# Altium schematic sheet SH4 - 17V BUCK CONVERTER.SchDoc: Power Distribution Board Rev2 - 17V Buck Converter
size Letter; DrawnBy: Cindy Li; Organization: UW Robotics; Address1: 200 University Avenue; Address2: Waterloo; Address3: Ontario; Address4: Canada N2L 3G6; DocumentNumber: 4; SheetNumber: 4; SheetTotal: 11
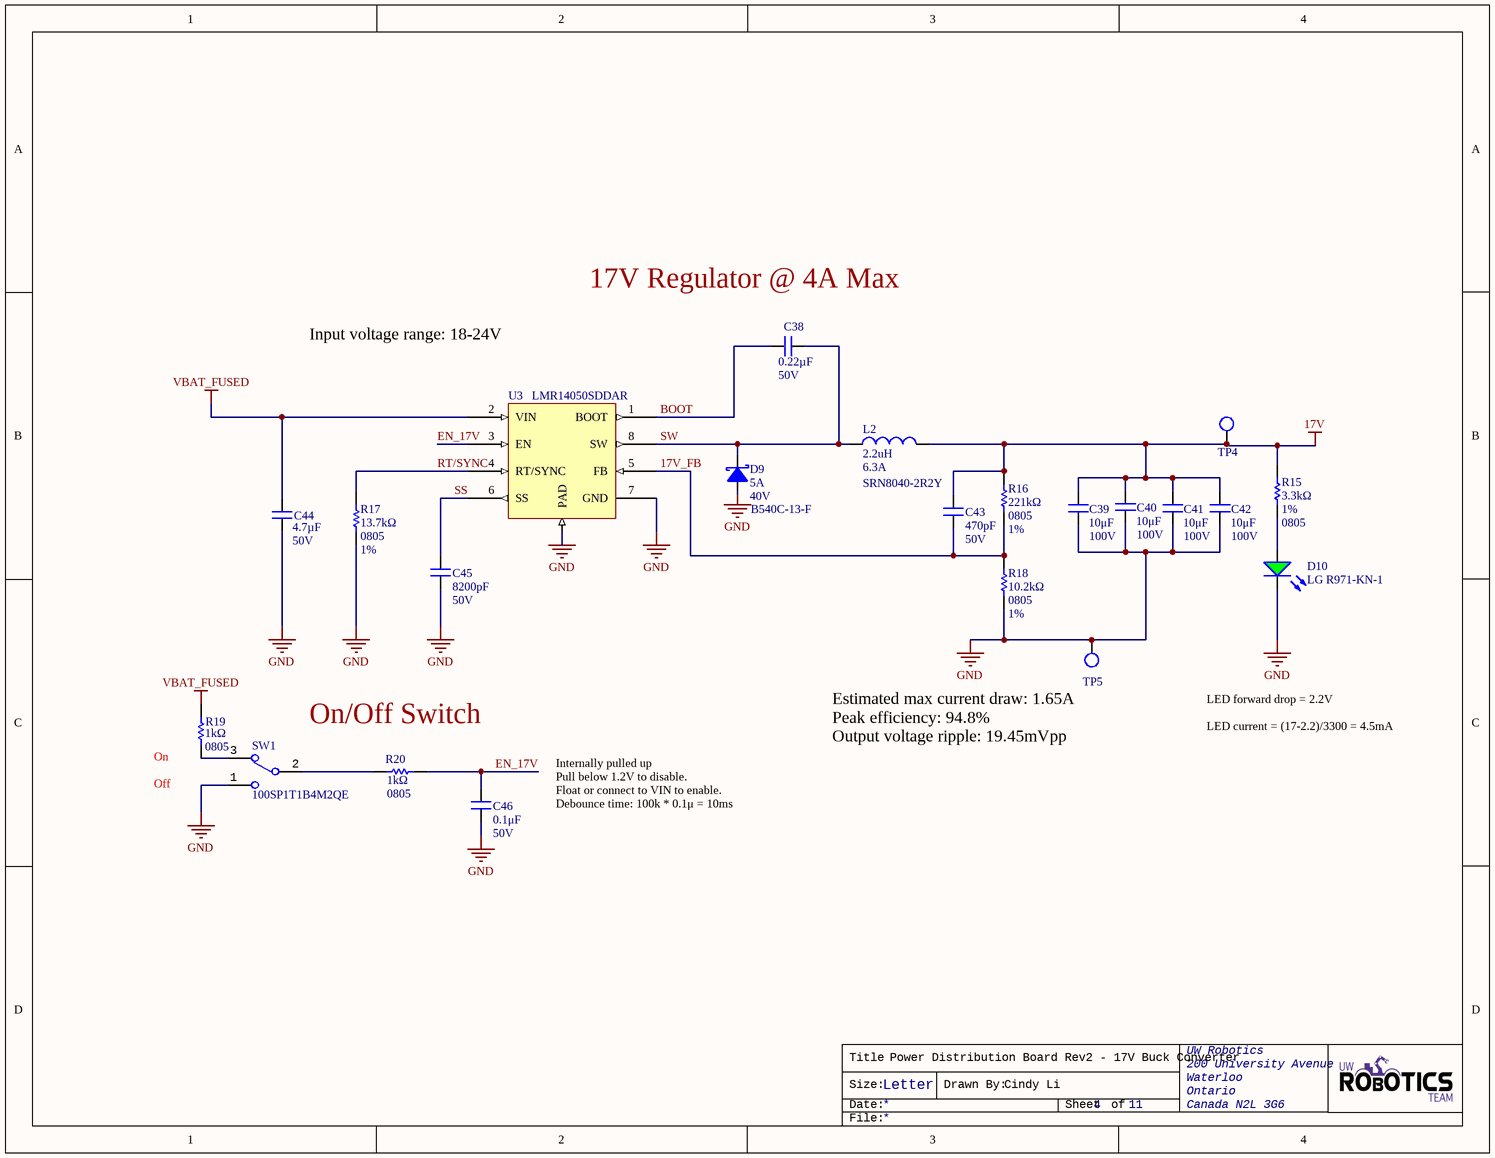
[diagram p0: SH4 - 17V BUCK CONVERTER.SchDoc]

## Parts
C38  Voltage Rating: 50V  Capacitance: 0.22µF  [CAP2012]  (hidden comment: GRM21BR71H224MA01L)
C39  value 10μF  Voltage Rating: 100V  [CAP1210]  (hidden comment: CAP_10uF_100V_1210)
C40  value 10μF  Voltage Rating: 100V  [CAP1210]  (hidden comment: CAP_10uF_100V_1210)
C41  value 10μF  Voltage Rating: 100V  [CAP1210]  (hidden comment: CAP_10uF_100V_1210)
C42  value 10μF  Voltage Rating: 100V  [CAP1210]  (hidden comment: CAP_10uF_100V_1210)
C43  470pF  Voltage Rating: 50V  [CAP2012]
C44  Voltage Rating: 50V  Capacitance: 4.7µF  [CAP1206]  (hidden comment: GRM31CR71H475KA12L)
C45  8200pF  Voltage Rating: 50V  [CAP2012]
C46  0.1μF  Voltage Rating: 50V  [CAP2012]
D9  Forward Current: 5A  Voltage: 40V  [DO214AB SMC]  (hidden comment: B540C-13-F)
D10  LG R971-KN-1  [LED_0805_GREEN]
L2  Inductance: 2.2uH  Max DC Current: 6.3A  [IND_BOURNS_SRN80]  (hidden comment: SRN8040-2R2Y)
R15  3.3kΩ  Tolerance: 1%  Case Code (Imperial): 0805  [RESC2012X60N]
R16  221kΩ  Case Code (Imperial): 0805  Tolerance: 1%  [RESC2012X60N]
R17  13.7kΩ  Case Code (Imperial): 0805  Tolerance: 1%  [RESC2012X60N]
R18  10.2kΩ  Case Code (Imperial): 0805  Tolerance: 1%  [RESC2012X60N]
R19  Case Code (Imperial): 0805  [RESC2012X60N]  (hidden comment: 1kΩ)
R20  1kΩ  Case Code (Imperial): 0805  [RESC2012X60N]
SW1  100SP1T1B4M2QE  [100SP1T1B4M2QE]
TP4  TESTPOINT_LOOP  [TESTPOINT_LOOP]  (value not drawn)
TP5  TESTPOINT_LOOP  [TESTPOINT_LOOP]  (value not drawn)
U3  LMR14050SDDAR  [8-PowerSOIC]

## Nets
17V: C39.2 C40.2 C41.2 C42.2 C43.2 L2.2 R15.2 R16.2 TP4.1
GND: C39.1 C40.1 C41.1 C42.1 C44.2 C45.1 C46.1 D9.1(Anode) D10.2(K) R17.1 R18.1 SW1.1 TP5.1 U3.7(GND) U3.9(PAD)
VBAT_FUSED: C44.1 R19.2 U3.2(VIN)
17V_FB: C43.1 R16.1 R18.2 U3.5(FB)
BOOT: C38.2 U3.1(BOOT)
EN_17V: C46.2 R20.2 U3.3(EN)
RT/SYNC: R17.2 U3.4(RT/SYNC)
SS: C45.2 U3.6(SS)
SW: C38.1 D9.2(Cathode) L2.1 U3.8(SW)
NetD10_1: D10.1(A) R15.1
NetR19_1: R19.1 SW1.3
NetR20_1: R20.1 SW1.2

## Notes on the sheet
- (near C38) 17V Regulator @ 4A Max
- Input voltage range: 18-24V
- (near R19) On
- On/Off Switch
- (near TP5) Estimated max current draw: 1.65A
  Peak efficiency: 94.8%
  Output voltage ripple: 19.45mVpp
- LED forward drop = 2.2V
  LED current = (17-2.2)/3300 = 4.5mA
- (near R19) Off
- Internally pulled up
  Pull below 1.2V to disable.
  Float or connect to VIN to enable.
  Debounce time: 100k * 0.1μ = 10ms
- Title
- Size:
- Date:
- Letter
- Drawn By:
- Sheet
- of
- File:

## Library data of the parts
C38 = GRM21BR71H224MA01L: CAP CER 0.22UF 50V X7R 0805; Manufacturer 1: Murata; Tolerance: 20%; Manufacturer Part Number 1: GRM21BR71H224MA01L; Mount: Surface Mount; Case/Package: 0805; Case Code (Metric): 2012; Case Code (Imperial): 0805; Min Operating Temperature: -55°C; Max Operating Temperature: 125°C; Dielectric: X7R; Termination: SMD/SMT; Voltage Rating (DC): 50V; Length: 2mm; Height: 1.25mm; Width: 0.049inch; Thickness: 0.053inch; Depth: 1.25mm; Supplier 1: Digi-Key; Supplier Part Number 1: 490-1671-1-ND; Package: 0805 (2012 Metric)
C39-C42 = CAP_10uF_100V_1210: CAP CER 10uF 100V X7S 10% 1210; Manufacturer 1: Murata; Manufacturer Part Number 1: GRM32EC72A106KE05L; Supplier Part Number 1: 490-16266-1-ND; Supplier 1: Digi-Key; Category: Ceramic Capacitors; Mount: Surface Mount; Case Code (Metric): 3225; Case Code (Imperial): 1210; Min Operating Temperature: -55°C; Max Operating Temperature: 125°C; Dielectric: X7S; Tolerance: 10%; Package: 1210 (3225 Metric)
C43 = CAP_470pF_50V_0805: CAP CER 470PF 50V X7R 0805; Manufacturer 1: Kyocera AVX; Manufacturer Part Number 1: 08055C471JAT2A; Tolerance: 5%; Dissipation Factor: 2.5%; Supplier 1: Digi-Key; Mount: Surface Mount; Number of Pins: 2; Case Code (Metric): 2012; Case Code (Imperial): 0805; Min Operating Temperature: -55°C; Max Operating Temperature: 125°C; Dielectric: X7R; Voltage Rating (DC): 50V; Termination: SMD/SMT; Length: 2.01mm; Height: 0.94mm; Width: 0.049inch; Thickness: 0.037inch; Depth: 1.25mm; REACH SVHC: Unknown; ComponentLink7URL: https://datasheet.ciiva.com/14906/cx7r-14906253.pdf?src-supplier=Digi-Key; ComponentLink7Description: https://datasheet.ciiva.com/14906/cx7r-14906253.pdf?src-supplier=Digi-Key; Supplier Part Number 1: 478-7958-1-ND; Capacitance: 470pF; Package: 0805 (2012 Metric); Contact Plating: Tin,Matte
C44 = GRM31CR71H475KA12L: CAP CER 4.7UF 50V X7R 1206; Manufacturer 1: Murata; Material: Ceramic; Tolerance: 10%; Value: 4.7µF; Supplier 1: Digi-Key; Manufacturer Part Number 1: GRM31CR71H475KA12L; Mount: Surface Mount; Case/Package: 1206; Case Code (Metric): 3216; Case Code (Imperial): 1206; Min Operating Temperature: -55°C; Max Operating Temperature: 125°C; Dielectric: X7R; Voltage Rating (DC): 50V; Termination: SMD/SMT; Voltage: 50V; Length: 3.2mm; Height: 1.6mm; Width: 0.063inch; Thickness: 0.071inch; Depth: 1.6mm; REACH SVHC: No SVHC; ComponentLink7URL: https://datasheet.ciiva.com/6270/partnumbering-e-01-6270218.pdf?src-supplier=Digi-Key; ComponentLink7Description: https://datasheet.ciiva.com/6270/partnumbering-e-01-6270218.pdf?src-supplier=Digi-Key; ComponentLink8URL: https://datasheet.ciiva.com/6270/partnumbering-e-01-6270219.pdf?src-supplier=Digi-Key; ComponentLink8Description: https://datasheet.ciiva.com/6270/partnumbering-e-01-6270219.pdf?src-supplier=Digi-Key; Supplier Part Number 1: 490-6521-1-ND; Package: 1206 (3216 Metric)
C45 = CAP_8200pF_50V_0805: CAP CER 8200PF 50V X7R 0805; Tolerance: 10%; Capacitance: 8.2nF; Mount: Surface Mount; Case Code (Metric): 2012; Case Code (Imperial): 0805; Min Operating Temperature: -55°C; Max Operating Temperature: 125°C; Dielectric: X7R; Voltage Rating (DC): 50V; Termination: SMD/SMT; Length: 0.079inch; Width: 0.049inch; Thickness: 0.037inch; Depth: 1.25mm; Supplier 1: Digi-Key; Supplier Part Number 1: 478-9924-6-ND; Number of Pins: 2; Ratings: AEC-Q200; Package: 0805 (2012 Metric)
C46 = CAP_0.1uF_50V_0805: CAP CER 0.1UF 50V X7R 0805; Manufacturer Part Number 1: GCD21BR71H104KA01L; Manufacturer 1: Murata Electronics; Tolerance: 10%; Package: 0805 (2012 Metric); Supplier Part Number 1: 490-11955-1-ND; Supplier 1: Digi-Key; Mount: Surface Mount; Value: 0.1μF; Case Code (Imperial): 0805; Case Code (Metric): 2012; Dielectric: X7R; Min Operating Temperature: -55°C; Max Operating Temperature: 125°C; Termination: SMD/SMT; Length: 2mm; Height: 1.25mm; Width: 0.049inch; Thickness: 0.049inch; Depth: 1.25mm; Ratings: AEC-Q200
D9 = B540C-13-F: DIODE SCHOTTKY 40V 5A SMC; Manufacturer 1: Diodes; Element Configuration: Single; Peak Reverse Current: 500uA; Peak Non-Repetitive Surge Current: 100A; Forward Voltage: 550mV; Polarity: Standard; Capacitance: 300pF; Supplier 1: Digi-Key; Manufacturer Part Number 1: B540C-13-F; Mount: Surface Mount; Case/Package: SMC; Number of Pins: 2; Weight: 0.007408oz; Contact Plating: Tin,Matte; Min Operating Temperature: -55°C; Max Operating Temperature: 125°C; Max Repetitive Reverse Voltage (Vrrm): 40V; Max Forward Surge Current (Ifsm): 100A; Average Rectified Current: 5A; Termination: SMD/SMT; Voltage Rating (DC): 40V; Current Rating: 5A; Output Current: 5A; Max Reverse Voltage (DC): 40V; Current: 5A; Length: 7.11mm; Height: 2.5mm; Width: 6.22mm; REACH SVHC: No SVHC; ComponentLink7URL: https://datasheet.ciiva.com/8303/ds13012-8303112.pdf?src-supplier=Avnet; ComponentLink7Description: https://datasheet.ciiva.com/8303/ds13012-8303112.pdf?src-supplier=Avnet; ComponentLink8URL: https://datasheet.ciiva.com/25919/ds13012-25919706.pdf?src-supplier=Avnet+Europe; ComponentLink8Description: https://datasheet.ciiva.com/25919/ds13012-25919706.pdf?src-supplier=Avnet+Europe; ComponentLink9URL: https://datasheet.ciiva.com/16200/ds13012-16200443.pdf?src-supplier=Future+Electronics; ComponentLink9Description: https://datasheet.ciiva.com/16200/ds13012-16200443.pdf?src-supplier=Future+Electronics; Supplier Part Number 1: B540C-FDIDKR-ND
D10 = DIO_LED_G: LED GREEN DIFFUSED 0805 SMD; Manufacturer 1: OSRAM; Forward Voltage Drop: 2.2V; Package: 0805 (2012 Metric); Manufacturer Part Number 1: LG R971-KN-1; Supplier Part Number 1: 475-1410-1-ND; Supplier 1: Digi-Key; Mount: Surface Mount
L2 = SRN8040-2R2Y: FIXED IND 2.2UH 6.3A 13 MOHM SMD; Manufacturer 1: Bourns; Core Material: Ferrite; Material: Steel; DC Resistance (DCR): 13mR; Tolerance: 30%; Self Resonant Frequency: 40MHz; Test Frequency: 100kHz; Shielding: Shielded; Saturation Current: 7.4A; Supplier 1: Digi-Key; Manufacturer Part Number 1: SRN8040-2R2Y; Mount: Surface Mount; Case/Package: Nonstandard; Number of Pins: 2; Weight: 0.028607oz; Contact Plating: Tin; Min Operating Temperature: -40°C; Max Operating Temperature: 125°C; Termination: SMD/SMT; Composition: Wirewound; DC Current: 6.3A; Military Standard: Not; RMS Current (Irms): 6.3A; Inductance Tolerance: 30%; Current Rating: 6.3A; Length: 8mm; Height: 4mm; Height - Seated (Max): 0.157inch; Depth: 8.3mm; Width: 8mm; REACH SVHC: No SVHC; ComponentLink7URL: https://datasheet.ciiva.com/1049/srn8040-1049455.pdf?src-supplier=Digi-Key; ComponentLink7Description: https://datasheet.ciiva.com/1049/srn8040-1049455.pdf?src-supplier=Digi-Key; ComponentLink8URL: https://datasheet.ciiva.com/17284/srn8040-17284783.pdf?src-supplier=Avnet+Europe; ComponentLink8Description: https://datasheet.ciiva.com/17284/srn8040-17284783.pdf?src-supplier=Avnet+Europe; ComponentLink9URL: https://datasheet.ciiva.com/48691/001056460-da-01-en-mag-abg-leist-ind-srn8040-2r2y-2-2uh-smd-48691836.pdf?src-supplier=Conrad; ComponentLink9Description: https://datasheet.ciiva.com/48691/001056460-da-01-en-mag-abg-leist-ind-srn8040-2r2y-2-2uh-smd-48691836.pdf?src-supplier=Conrad; Supplier Part Number 1: SRN8040-2R2YCT-ND
R15 = RES_3.3kΩ_0805_1%: RES 3.3K OHM 1% 1/8W 0805; Resistance: 3.3kR; Temperature Coefficient: 100ppm/°C; Power Rating: 125mW; Voltage Rating: 150V; Package: 0805 (2012 Metric); Supplier 1: Digi-Key; Mount: Surface Mount; Case Code (Metric): 2012; Weight: 0.000194oz; Contact Plating: Tin; Min Operating Temperature: -55°C; Max Operating Temperature: 155°C; Composition: Thick Film; Number of Terminations: 2; Termination: SMD/SMT; Max Power Dissipation: 125mW; Voltage Rating (DC): 150V; Features: Automotive AEC-Q200; Military Standard: Not; Length: 2mm; Height: 0.45mm; Width: 1.25mm; Depth: 1.25mm; REACH SVHC: Unknown; ComponentLink7URL: https://datasheet.ciiva.com/2467/dcrcwe3-2467823.pdf?src-supplier=Digi-Key; ComponentLink7Description: https://datasheet.ciiva.com/2467/dcrcwe3-2467823.pdf?src-supplier=Digi-Key; ComponentLink8URL: https://datasheet.ciiva.com/9080/dcrcwe3-9080591.pdf?src-supplier=Avnet; ComponentLink8Description: https://datasheet.ciiva.com/9080/dcrcwe3-9080591.pdf?src-supplier=Avnet; ComponentLink9URL: https://datasheet.ciiva.com/16430/dcrcwe3-16430277.pdf?src-supplier=Future+Electronics; ComponentLink9Description: https://datasheet.ciiva.com/16430/dcrcwe3-16430277.pdf?src-supplier=Future+Electronics; ComponentLink10URL: https://datasheet.ciiva.com/26312/fld-crcw-e3-data-en-26312934.pdf?src-supplier=Distrelec; ComponentLink10Description: https://datasheet.ciiva.com/26312/fld-crcw-e3-data-en-26312934.pdf?src-supplier=Distrelec; ComponentLink11URL: https://datasheet.ciiva.com/16778/70201119-16778680.pdf?src-supplier=Allied+Electronics; ComponentLink11Description: https://datasheet.ciiva.com/16778/70201119-16778680.pdf?src-supplier=Allied+Electronics; Supplier Part Number 1: 541-3.30KHCT-ND
R16 = RES_221kΩ_0805_1%: RES 221K OHM 1% 1/8W 0805; Manufacturer 1: Vishay; Manufacturer Part Number 1: CRCW0805221KFKEA; Power Rating: 125mW; Voltage Rating: 150V; Temperature Coefficient: 100ppm/°C; Resistance: 221kR; Supplier 1: Digi-Key; Mount: Surface Mount; Contact Plating: Tin; Case Code (Metric): 2012; Min Operating Temperature: -55°C; Max Operating Temperature: 155°C; Voltage Rating (DC): 150V; Composition: Thick Film; Number of Terminations: 2; Termination: SMD/SMT; Military Standard: Not; Features: Automotive AEC-Q200; Length: 2mm; Height: 0.45mm; Width: 1.25mm; Depth: 1.25mm; REACH SVHC: Unknown; ComponentLink7URL: https://datasheet.ciiva.com/2467/dcrcwe3-2467622.pdf?src-supplier=Digi-Key; ComponentLink7Description: https://datasheet.ciiva.com/2467/dcrcwe3-2467622.pdf?src-supplier=Digi-Key; ComponentLink8URL: https://datasheet.ciiva.com/3258/dcrcwe3-3258329.pdf?src-supplier=Avnet; ComponentLink8Description: https://datasheet.ciiva.com/3258/dcrcwe3-3258329.pdf?src-supplier=Avnet; Supplier Part Number 1: 541-221KCCT-ND; Max Power Dissipation: 125mW; Number of Pins: 2; Weight: 0.000194oz; ComponentLink9URL: https://datasheet.ciiva.com/7674/1533075-7674218.pdf?src-supplier=Element14; ComponentLink9Description: https://datasheet.ciiva.com/7674/1533075-7674218.pdf?src-supplier=Element14; ComponentLink10URL: https://datasheet.ciiva.com/22870/70201119-22870172.pdf?src-supplier=Allied+Electronics; ComponentLink10Description: https://datasheet.ciiva.com/22870/70201119-22870172.pdf?src-supplier=Allied+Electronics; Package: 0805 (2012 Metric)
R17 = RES_13.7kΩ_0805_1%: RES 13.7K OHM 1% 1/8W 0805; Manufacturer 1: Vishay; Manufacturer Part Number 1: CRCW080513K7FKEA; Temperature Coefficient: 100ppm/°C; Voltage Rating (DC): 150V; Power Rating: 125mW; Resistance: 13.7kR; Supplier 1: Digi-Key; Number of Pins: 2; Weight: 0.000194oz; Case Code (Metric): 2012; Contact Plating: Tin; Min Operating Temperature: -55°C; Max Operating Temperature: 155°C; Composition: Thick Film; Termination: SMD/SMT; Military Standard: Not; Length: 2mm; Height: 0.45mm; Width: 0.049inch; Depth: 1.25mm; REACH SVHC: Unknown; Supplier Part Number 1: 541-13.7KCCT-ND; Voltage Rating: 150V; Number of Terminations: 2; Max Power Dissipation: 125mW; Features: Automotive AEC-Q200; ComponentLink7URL: https://datasheet.ciiva.com/22675/1847332-22675191.pdf?src-supplier=Element14; ComponentLink7Description: https://datasheet.ciiva.com/22675/1847332-22675191.pdf?src-supplier=Element14; ComponentLink8URL: https://datasheet.ciiva.com/7663/1697337-7663928.pdf?src-supplier=Element14; ComponentLink8Description: https://datasheet.ciiva.com/7663/1697337-7663928.pdf?src-supplier=Element14; ComponentLink9URL: https://datasheet.ciiva.com/3258/dcrcwe3-3258107.pdf?src-supplier=Avnet; ComponentLink9Description: https://datasheet.ciiva.com/3258/dcrcwe3-3258107.pdf?src-supplier=Avnet; ComponentLink10URL: https://datasheet.ciiva.com/16778/70201119-16778860.pdf?src-supplier=Allied+Electronics; ComponentLink10Description: https://datasheet.ciiva.com/16778/70201119-16778860.pdf?src-supplier=Allied+Electronics; ComponentLink11URL: https://datasheet.ciiva.com/17188/dcrcwe3-17188109.pdf?src-supplier=Avnet+Europe; ComponentLink11Description: https://datasheet.ciiva.com/17188/dcrcwe3-17188109.pdf?src-supplier=Avnet+Europe; Package: 0805 (2012 Metric)
R18 = RES_10.2kΩ_0805_1%: RES 10.2K OHM 1% 1/8W 0805; Manufacturer 1: Vishay; Manufacturer Part Number 1: CRCW080510K2FKEA; Temperature Coefficient: 100ppm/°C; Power Rating: 125mW; Voltage Rating: 150V; Resistance: 10.2kR; Supplier 1: Digi-Key; Number of Pins: 2; Weight: 0.000194oz; Contact Plating: Tin; Case Code (Metric): 2012; Min Operating Temperature: -55°C; Max Operating Temperature: 155°C; Composition: Thick Film; Features: Automotive AEC-Q200; Termination: SMD/SMT; Number of Terminations: 2; Military Standard: Not; Length: 2mm; Height: 0.45mm; Width: 0.049inch; Depth: 1.25mm; REACH SVHC: Unknown; ComponentLink7URL: https://datasheet.ciiva.com/22702/1697337-22702902.pdf?src-supplier=Element14; ComponentLink7Description: https://datasheet.ciiva.com/22702/1697337-22702902.pdf?src-supplier=Element14; ComponentLink8URL: https://datasheet.ciiva.com/16204/dcrcwe3-16204135.pdf?src-supplier=Future+Electronics; ComponentLink8Description: https://datasheet.ciiva.com/16204/dcrcwe3-16204135.pdf?src-supplier=Future+Electronics; ComponentLink9URL: https://datasheet.ciiva.com/16852/dcrcwe3-16852825.pdf?src-supplier=Avnet+Europe; ComponentLink9Description: https://datasheet.ciiva.com/16852/dcrcwe3-16852825.pdf?src-supplier=Avnet+Europe; ComponentLink10URL: https://datasheet.ciiva.com/7663/1697337-7663915.pdf?src-supplier=Element14; ComponentLink10Description: https://datasheet.ciiva.com/7663/1697337-7663915.pdf?src-supplier=Element14; ComponentLink11URL: https://datasheet.ciiva.com/7663/1697337-7663916.pdf?src-supplier=Element14; ComponentLink11Description: https://datasheet.ciiva.com/7663/1697337-7663916.pdf?src-supplier=Element14; ComponentLink12URL: https://datasheet.ciiva.com/22674/1825492-22674606.pdf?src-supplier=Element14; ComponentLink12Description: https://datasheet.ciiva.com/22674/1825492-22674606.pdf?src-supplier=Element14; ComponentLink13URL: https://datasheet.ciiva.com/3258/dcrcwe3-3258031.pdf?src-supplier=Avnet; ComponentLink13Description: https://datasheet.ciiva.com/3258/dcrcwe3-3258031.pdf?src-supplier=Avnet; Supplier Part Number 1: 541-10.2KCCT-ND; Max Power Dissipation: 125mW; Package: 0805 (2012 Metric); Voltage Rating (DC): 150V; Working Voltage: 150V
R19 R20 = RES_1kΩ_0805_1%: RES 1K OHM 1% 1/8W 0805; Manufacturer 1: Yageo; Manufacturer Part Number 1: RC0805FR-071KL; Power Rating: 125mW; Temperature Coefficient: 25ppm/°C; Voltage Rating: 150V; Supplier 1: Digi-Key; Case Code (Metric): 2012; Min Operating Temperature: -55°C; Max Operating Temperature: 155°C; Resistance: 1K; Tolerance: 1%; Termination: SMD/SMT; Supplier Part Number 1: 311-1.00KCRCT-ND; Package: 0805 (2012 Metric); Mount: Surface Mount; Case/Package: 0805; Number of Pins: 2; Weight: 0.000194oz; Contact Plating: Tin; Composition: Thin Film; Number of Terminations: 2; Voltage Rating (DC): 150V; Max Power Dissipation: 125mW; Features: Moisture Resistant,Automotive AEC-Q200,Anti-Sulfur; Military Standard: Not; Length: 2mm; Height: 0.022inch; Width: 0.049inch; Depth: 1.25mm; REACH SVHC: Unknown; Value: 1kΩ
SW1 = SW_SPDT: SWITCH TOGGLE SPDT 5A 120V; Manufacturer 1: E-Switch; Actuator Material: Brass,Chrome; Electrical Life: 40000Cycles; Actuator Type: Standard Round; Voltage Rating (DC): 28V; Illumination Type: Non-Illuminated,Illuminated; Switch Function: On-On; Actuator Length: 12.19mm; Supplier 1: Digi-Key; Manufacturer Part Number 1: 100SP1T1B4M2QE; Mount: Through Hole; Contact Material: Silver; Contact Plating: Silver; Min Operating Temperature: -30°C; Max Operating Temperature: 85°C; Termination: PC Pin; Throw Configuration: SPDT; Orientation: Vertical; Voltage Rating (AC): 120V; Supplier Part Number 1: EG2355-ND; Current Rating: 5A
TP4 TP5 = TESTPOINT_LOOP: PC TEST POINT MINIATURE WHITE; Manufacturer 1: Keystone Electronics; Manufacturer Part Number 1: 5002; Supplier 1: Digi-Key; Mount: Through Hole; Supplier Part Number 1: 36-5002-ND
U3 = LMR14050SDDAR: IC REG BUCK ADJUSTABLE 5A 8SOPWR; Manufacturer 1: Texas Instruments; Output Configuration: Positive; Number of Outputs: 1; Min Input Voltage: 4V; Max Input Voltage: 40V; Min Output Voltage: 800mV; Max Output Voltage: 28V; Switching Frequency: 2.5MHz; Synchronous Rectifier: No; Quiescent Current: 40uA; Supplier 1: Digi-Key; Manufacturer Part Number 1: LMR14050SDDAR; Mount: Surface Mount; Number of Pins: 8; Min Operating Temperature: -40°C; Max Operating Temperature: 125°C; Output Type: Adjustable; Output Current: 5A; Case/Package: 8-PowerSOIC; Supplier Part Number 1: 296-44322-1-ND